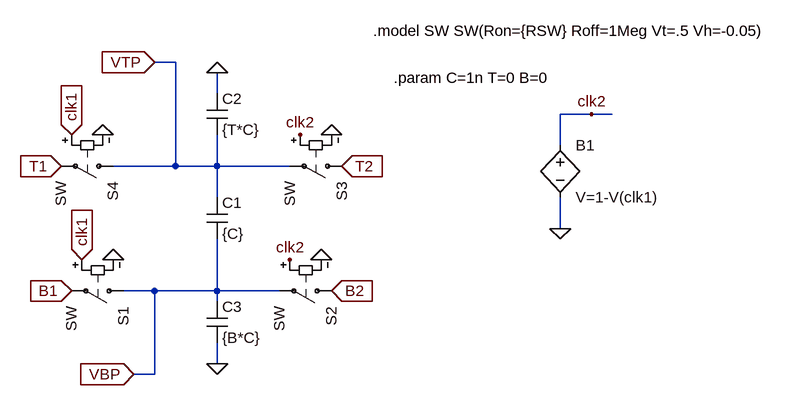
[diagram p0: schematic SCcore.asc]
SCcore.asc, the LTspice schematic file:
Version 4
SHEET 1 1152 680
WIRE 160 -128 128 -128
WIRE 224 -80 224 -112
WIRE 800 -48 752 -48
WIRE 832 -48 800 -48
WIRE 752 0 752 -48
WIRE 160 32 160 -128
WIRE 160 32 64 32
WIRE 224 32 224 -16
WIRE 224 32 160 32
WIRE 336 32 224 32
WIRE 224 80 224 32
WIRE 752 128 752 80
WIRE 128 224 80 224
WIRE 224 224 224 144
WIRE 224 224 128 224
WIRE 320 224 224 224
WIRE 224 240 224 224
WIRE 224 336 224 304
WIRE 128 352 128 224
WIRE 128 352 96 352
FLAG 224 336 0
FLAG 224 -112 0
FLAG 416 32 T2
IOPIN 416 32 In
FLAG -16 32 T1
IOPIN -16 32 In
FLAG 400 224 B2
IOPIN 400 224 In
FLAG 0 224 B1
IOPIN 0 224 In
FLAG 0 -16 clk1
IOPIN 0 -16 In
FLAG 16 176 clk1
IOPIN 16 176 In
FLAG 352 -16 clk2
FLAG 48 -16 0
FLAG 400 -16 0
FLAG 384 176 0
FLAG 64 176 0
FLAG 752 128 0
FLAG 800 -48 clk2
FLAG 336 176 clk2
FLAG 128 -128 VTP
IOPIN 128 -128 In
FLAG 96 352 VBP
IOPIN 96 352 In
SYMBOL cap 208 80 R0
SYMATTR InstName C1
SYMATTR Value {C}
SYMBOL cap 208 -80 R0
SYMATTR InstName C2
SYMATTR Value {T*C}
SYMBOL cap 208 240 R0
SYMATTR InstName C3
SYMATTR Value {B*C}
SYMBOL sw 96 224 R90
SYMATTR InstName S1
SYMBOL sw 416 224 R90
SYMATTR InstName S2
SYMBOL sw 432 32 R90
SYMATTR InstName S3
SYMBOL sw 80 32 R90
SYMATTR InstName S4
SYMBOL bv 752 -16 R0
SYMATTR InstName B1
SYMATTR Value V=1-V(clk1)
TEXT 464 -176 Left 2 !.model SW SW(Ron={RSW} Roff=1Meg Vt=.5 Vh=-0.05)
TEXT 496 -104 Left 2 !.param C=1n T=0 B=0

The netlist it stands for:
* SCcore.asc
C1 VTP VBP {C}
C2 0 VTP {T*C}
C3 VBP 0 {B*C}
S1 VBP B1 clk1 0 SW
S2 B2 VBP clk2 0 SW
S3 T2 VTP clk2 0 SW
S4 VTP T1 clk1 0 SW
B1 clk2 0 V=1-V(clk1)
.model SW SW(Ron={RSW} Roff=1Meg Vt=.5 Vh=-0.05)
.param C=1n T=0 B=0
.backanno
.end